# EAGLE schematic demultiplexer (EAGLE 6.3)
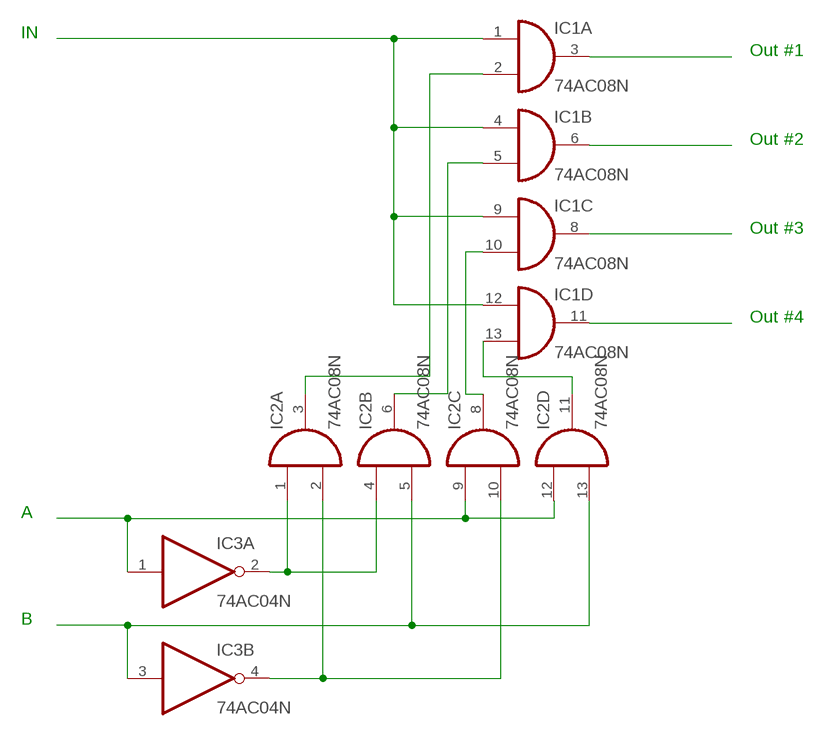
[diagram p0: schematic, sheet 1]

## Parts
IC1  74AC08N  [DIL14]
IC2  74AC08N  [DIL14]
IC3  74AC04N  [DIL14]

## Nets
N$1: IC2.5(B:I1) IC2.13(D:I1) IC3.3(B:I)
N$2: IC1.13(D:I1) IC2.11(D:O)
N$3: IC1.10(C:I1) IC2.8(C:O)
N$4: IC1.5(B:I1) IC2.6(B:O)
N$5: IC1.2(A:I1) IC2.3(A:O)
N$6: IC2.9(C:I0) IC2.12(D:I0) IC3.1(A:I)
N$7: IC1.8(C:O)
N$8: IC2.1(A:I0) IC2.4(B:I0) IC3.2(A:O)
N$9: IC2.2(A:I1) IC2.10(C:I1) IC3.4(B:O)
N$10: IC1.3(A:O)
N$11: IC1.1(A:I0) IC1.4(B:I0) IC1.9(C:I0) IC1.12(D:I0)
N$12: IC1.6(B:O)
N$13: IC1.11(D:O)
Unconnected: IC3.5(C:I) IC3.6(C:O) IC3.8(D:O) IC3.9(D:I) IC3.10(E:O) IC3.11(E:I) IC3.12(F:O) IC3.13(F:I)

## Notes on the sheet
- IN
- Out #1
- Out #2
- Out #3
- Out #4
- A
- B

## Power pins joined to a net without a drawn wire
GND: IC1.7(P:GND) IC2.7(P:GND) IC3.7(P:GND)
VCC: IC1.14(P:VCC) IC2.14(P:VCC) IC3.14(P:VCC)

## Library data of the parts
IC1 IC2 = 74xx-eu:74*08: Quad 2-input AND gate
IC3 = 74xx-eu:74*04: Hex INVERTER